# EAGLE design usb1wire (EAGLE 6.2)
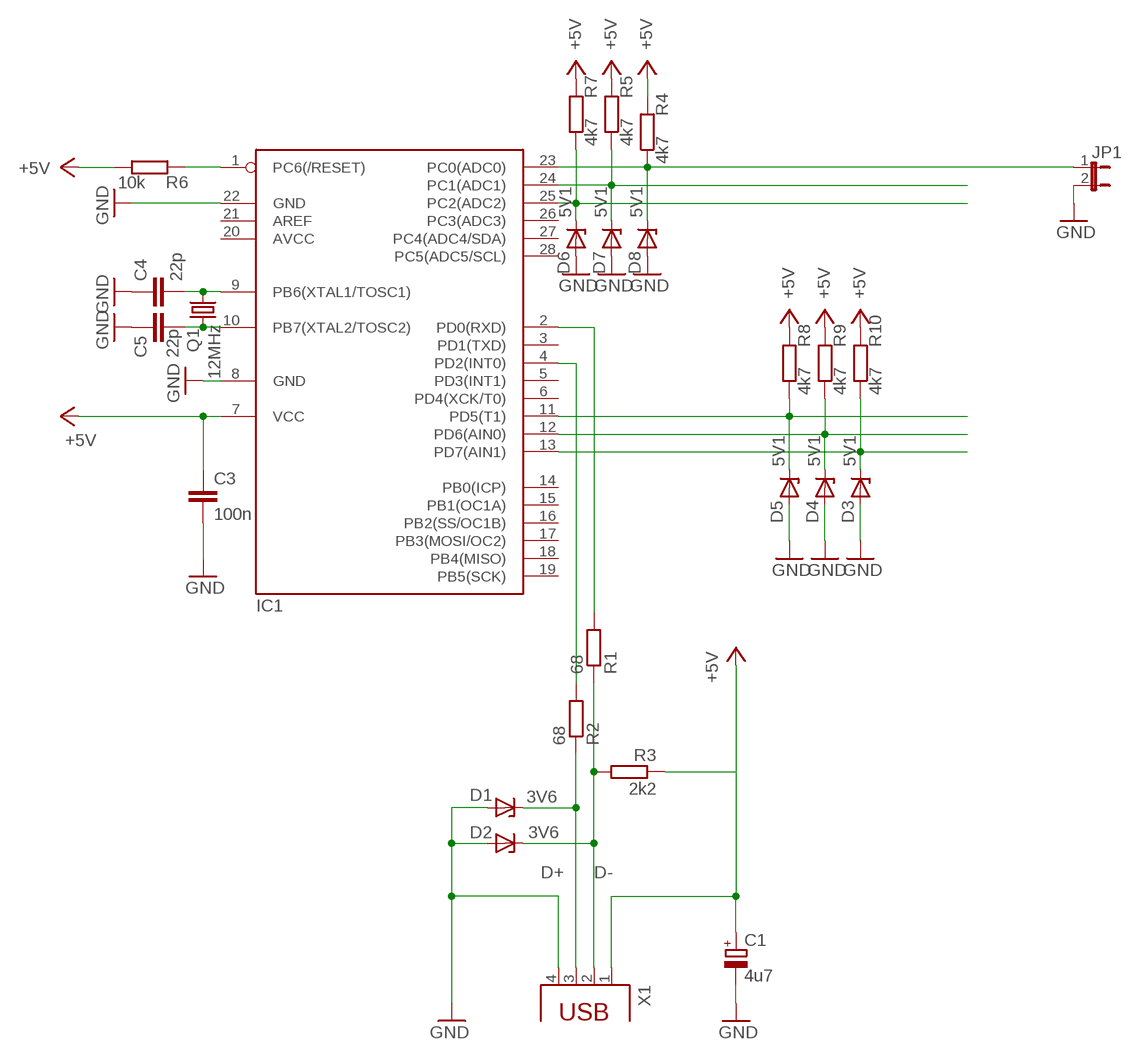
[diagram p0: schematic, sheet 1]

## Parts
C1  4u7  CPOL-EUTT2D4  [TT2D4]
C3  100n  C-EU025-024X044  [C025-024X044]
C4  22p  C-EU025-024X044  [C025-024X044]
C5  22p  C-EU050-025X075  [C050-025X075]
D1  3V6  ZENER-DIODEDO34-7  [DO34Z7]
D2  3V6  ZENER-DIODEZD-5  [ZDIO-5]
D3  5V1  ZENER-DIODEZD-5  [ZDIO-5]
D4  5V1  ZENER-DIODEDO34-7  [DO34Z7]
D5  5V1  ZENER-DIODEDO41Z10  [DO41Z10]
D6  5V1  ZENER-DIODESOD80C  [SOD80C]
D7  5V1  ZENER-DIODESOD80C  [SOD80C]
D8  5V1  ZENER-DIODESOD80C  [SOD80C]
IC1  MEGA8-P  [DIL28-3]
JP1  JP1E  [JP1]
Q1  12MHz  CRYSTALTC26V  [TC26V]
R1  68  R-EU_0207/10  [0207/10]
R2  68  R-EU_0204/2V  [0204V]
R3  2k2  R-EU_0207/2V  [0207/2V]
R4  4k7  R-EU_0207/15  [0207/15]
R5  4k7  R-EU_0207/12  [0207/12]
R6  10k  R-EU_0207/15  [0207/15]
R7  4k7  R-EU_0207/10  [0207/10]
R8  4k7  R-EU_0207/12  [0207/12]
R9  4k7  R-EU_0207/10  [0207/10]
R10  4k7  R-EU_0204/7  [0204/7]
X1  PN61729  [PN61729]

## Nets
+5V: C1.+ C3.1 IC1.7(VCC) R3.1 R4.2 R5.2 R6.1 R7.2 R8.2 R9.2 R10.2 X1.1
D+: D1.C R2.1 X1.3
D-: D2.C R1.1 R3.2 X1.2
GND: C1.- C3.2 C4.1 C5.1 D1.A D2.A D3.A D4.A D5.A D6.A D7.A D8.A IC1.8(GND) IC1.22(GND) JP1.2 X1.4
N$1: IC1.1(PC6(/RESET)) R6.2
N$2: IC1.2(PD0(RXD)) R1.2
N$3: IC1.4(PD2(INT0)) R2.2
N$4: D8.C IC1.23(PC0(ADC0)) JP1.1 R4.1
N$5: D3.C IC1.13(PD7(AIN1)) R10.1
N$6: D7.C IC1.24(PC1(ADC1)) R5.1
N$7: D6.C IC1.25(PC2(ADC2)) R7.1
N$8: D4.C IC1.12(PD6(AIN0)) R9.1
N$9: D5.C IC1.11(PD5(T1)) R8.1
N$22: C4.2 IC1.9(PB6(XTAL1/TOSC1)) Q1.2
N$23: C5.2 IC1.10(PB7(XTAL2/TOSC2)) Q1.1
Unconnected: IC1.3(PD1(TXD)) IC1.5(PD3(INT1)) IC1.6(PD4(XCK/T0)) IC1.14(PB0(ICP)) IC1.15(PB1(OC1A)) IC1.16(PB2(SS/OC1B)) IC1.17(PB3(MOSI/OC2)) IC1.18(PB4(MISO)) IC1.19(PB5(SCK)) IC1.21(AREF) IC1.26(PC3(ADC3)) IC1.27(PC4(ADC4/SDA)) IC1.28(PC5(ADC5/SCL))

## Power pins joined to a net without a drawn wire
AVCC: IC1.20(AVCC)

## Library data of the parts
C1 = rcl:CPOL-EU: POLARIZED CAPACITOR, European symbol
C3-C5 = rcl:C-EU: CAPACITOR, European symbol
D1-D8 = diode:ZENER-DIODE: Z-Diode
IC1 = atmel:MEGA8-P: MICROCONTROLLER 8 Kbytes FLASH, 1 kbytes SRAM, 512 bytes EEPROM, USART, 4-channel 10 bit ADC, 2-channel 8 bit ADC Pin compatible with Atmega48, ATMega88, ATMega168 Source: avr.lbr
JP1 = jumper:JP1E: JUMPER
Q1 = crystal:CRYSTAL: CRYSTAL
R1-R10 = rcl:R-EU_: RESISTOR, European symbol
X1 = con-berg:PN61729: BERG USB connector

## Board
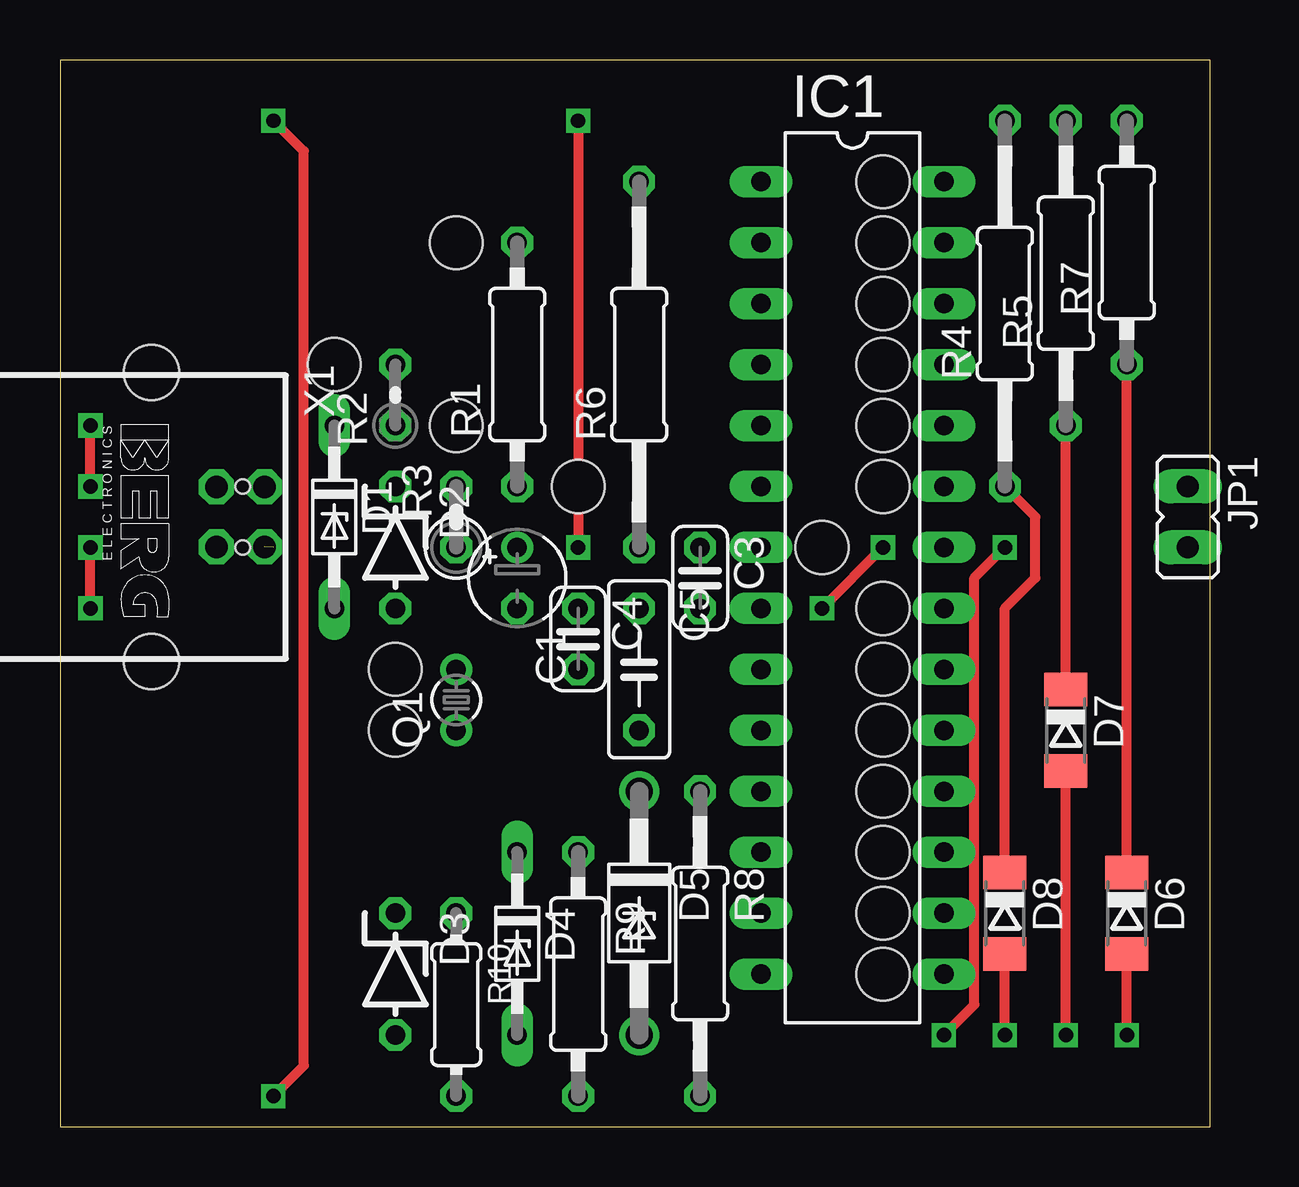
[diagram p1: board, top side]
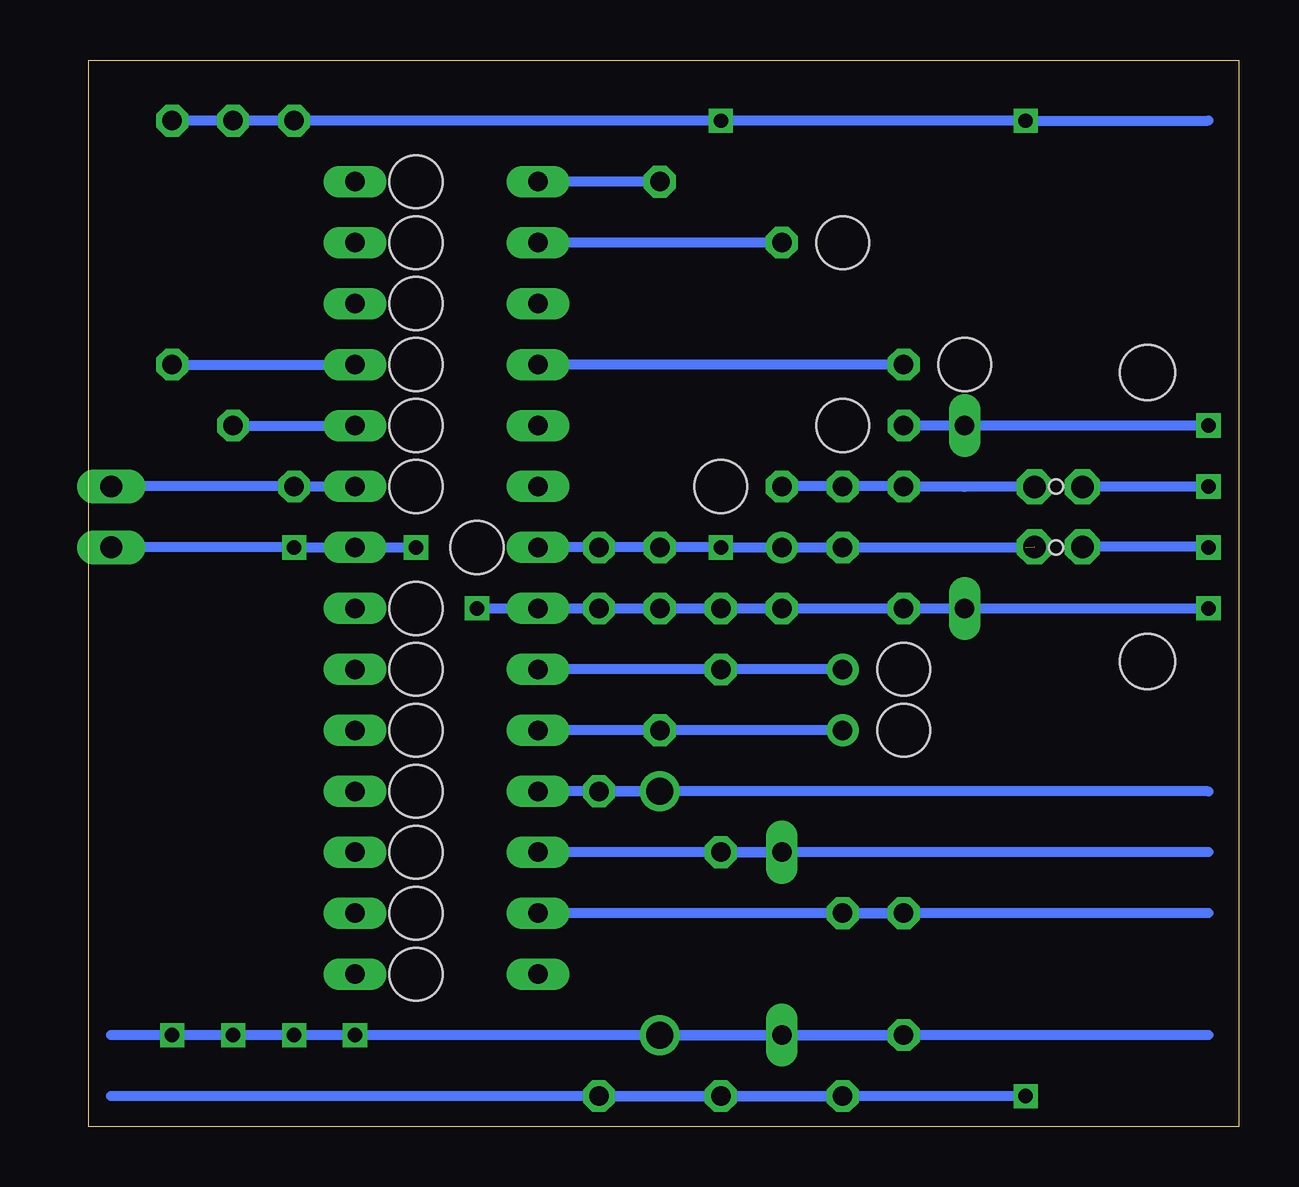
[diagram p2: board, bottom side, seen from below]

Size 47.93 x 44.44 mm. Coordinates in mm from the lower left corner, seen from the top.
Outline: 0,0 47.93,0 47.93,44.44 0,44.44 0,0
Copper layers (1*16): Top 0.035mm / dielectric 1.5mm / Bottom 0.035mm
Design rules: minimum track width 10mil, minimum drill 24mil, track to track 8mil, track to pad 8mil, pad to pad 8mil, via to via 8mil, smd to smd 8mil, copper to edge 40mil, drill to drill 8mil, minimum pad ring 10mil, minimum via ring 8mil, stop-mask expansion 4mil, vias tented up to drill 0mil, thermal gap 10mil
Holes 2.2 mm at 16.51,29.21 21.59,26.67 34.29,39.37 34.29,36.83 34.29,34.29 34.29,31.75 34.29,29.21 34.29,26.67 31.75,24.13 34.29,21.59 34.29,19.05 34.29,16.51 34.29,13.97 34.29,11.43 34.29,8.89 34.29,6.35 13.97,19.05 13.97,16.51 11.43,31.75 16.51,36.83
Holes 0.6 mm at 7.62,24.13 7.62,26.67

### Footprints (pad centres in the part's own frame; a part is rotated, then mirrored left to right if it is on the bottom)
TT2D4 = drill 0.813: + -1.27,0 | drill 0.813 octagon: - 1.27,0
C025-024X044 = drill 0.813 octagon: 1 -1.27,0; 2 1.27,0
C050-025X075 = drill 0.813 octagon: 1 -2.54,0; 2 2.54,0
DO34Z7 = drill 0.813 long: A 3.81,0; C -3.81,0
ZDIO-5 = drill 0.813 octagon: A 2.54,0; C -2.54,0
DO41Z10 = drill 1.118: A 5.08,0; C -5.08,0
SOD80C = smd 1.4 x 1.8: A 1.7,0; C -1.7,0
DIL28-3 = drill 0.813 long: 1 -16.51,-3.81; 2 -13.97,-3.81; 3 -11.43,-3.81; 4 -8.89,-3.81; 5 -6.35,-3.81; 6 -3.81,-3.81; 7 -1.27,-3.81; 8 1.27,-3.81; 9 3.81,-3.81; 10 6.35,-3.81; 11 8.89,-3.81; 12 11.43,-3.81; 13 13.97,-3.81; 14 16.51,-3.81; 15 16.51,3.81; 16 13.97,3.81; 17 11.43,3.81; 18 8.89,3.81; 19 6.35,3.81; 20 3.81,3.81; 21 1.27,3.81; 22 -1.27,3.81; 23 -3.81,3.81; 24 -6.35,3.81; 25 -8.89,3.81; 26 -11.43,3.81; 27 -13.97,3.81; 28 -16.51,3.81
JP1 = drill 0.914 long: 1 0,-1.27; 2 0,1.27
TC26V = drill 0.813: 1 -1.27,0; 2 1.27,0
0207/10 = drill 0.813 octagon: 1 -5.08,0; 2 5.08,0
0204V = drill 0.813 octagon: 1 -1.27,0; 2 1.27,0
0207/2V = drill 0.813 octagon: 1 -1.27,0; 2 1.27,0
0207/15 = drill 0.813 octagon: 1 -7.62,0; 2 7.62,0
0207/12 = drill 0.813 octagon: 1 -6.35,0; 2 6.35,0
0204/7 = drill 0.813 octagon: 1 -3.81,0; 2 3.81,0
PN61729 = drill 0.95 octagon: 1 1.25,4.71; 2 -1.25,4.71; 3 -1.25,2.71; 4 1.25,2.71 | hole 2.3: -6.02,0; 6.02,0

### Placement (x,y rotation side)
C1  19.05,22.86 270 top
C3  26.67,22.86 270 top
C4  21.59,20.32 270 top
C5  24.13,19.05 270 top
D1  11.43,25.4 270 top
D2  13.97,24.13 270 top
D3  13.97,6.35 270 top
D4  19.05,7.62 270 top
D5  24.13,8.89 270 top
D6  44.45,8.89 270 top
D7  41.91,16.51 270 top
D8  39.37,8.89 270 top
IC1  33.02,22.86 270 top
JP1  46.99,25.4 180 top
Q1  16.51,17.78 90 top
R1  19.05,31.75 90 top
R2  13.97,30.48 90 top
R3  16.51,25.4 90 top
R4  39.37,34.29 90 top
R5  41.91,35.56 90 top
R6  24.13,31.75 90 top
R7  44.45,36.83 90 top
R8  26.67,7.62 270 top
R9  21.59,6.35 270 top
R10  16.51,5.08 270 top
X1  3.81,25.4 270 top

### Tracks (layer width: path | path; a pad name or v marks a point on that pad's centre or on a via)
+5V  (via drill 0.6)  (1 unrouted)
  Top 0.406: v21.59,41.91 v21.59,24.13 | v8.89,41.91 10.16,40.64 10.16,2.54 v8.89,1.27
  Bottom 0.406: 8.89,24.13 R3.1 C1.+ v21.59,24.13 R6.1 C3.1 IC1.7 | R7.2 R5.2 R4.2 v21.59,41.91 v8.89,41.91 1.27,41.91 | v8.89,1.27 R8.2 | R8.2 R9.2 R10.2 R8.2 | R8.2 46.99,1.27
D+  (via drill 0.6)
  Top 0.406: v1.27,26.67 v1.27,29.21
  Bottom 0.406: R2.1 D1.C v1.27,29.21 | X1.3 1.27,26.65 v1.27,26.67
D-
  Bottom 0.406: D2.C R3.2 R1.1 | D2.C 11.43,26.65 X1.2 | D2.C 11.43,26.67
GND  (via drill 0.6)
  Top 0.406: v1.27,21.59 v1.27,24.13 | v34.29,24.13 v31.75,21.59 | v44.45,3.81 D6.A | v41.91,3.81 D7.A | v39.37,3.81 D8.A | v39.37,24.13 38.1,22.86 38.1,5.08 v36.83,3.81
  Bottom 0.406: 1.27,24.15 1.27,24.16 | IC1.8 C5.1 C4.1 C1.- D2.A D1.A v1.27,21.59 | IC1.8 C3.2 | 1.27,24.15 X1.4 | v1.27,24.13 1.27,24.15 | v34.29,24.13 IC1.22 v39.37,24.13 JP1.2 | v31.75,21.59 IC1.8 | 46.99,3.81 v44.45,3.81 v41.91,3.81 v39.37,3.81 v36.83,3.81 D3.A D4.A D5.A 1.27,3.81
N$1
  Bottom 0.406: R6.2 IC1.1
N$2
  Bottom 0.406: R1.2 IC1.2
N$3
  Bottom 0.406: R2.2 IC1.4
N$4
  Top 0.406: D8.C 39.37,21.59 40.64,22.86 40.64,25.4 R4.1
  Bottom 0.406: JP1.1 R4.1 IC1.23
N$5
  Bottom 0.406: IC1.13 D3.C R10.1 1.27,8.89
N$6
  Top 0.406: D7.C R5.1
  Bottom 0.406: R5.1 IC1.24
N$7
  Top 0.406: D6.C R7.1
  Bottom 0.406: R7.1 IC1.25
N$8
  Bottom 0.406: IC1.12 D4.C R9.1 1.27,11.43
N$9
  Bottom 0.406: IC1.11 D5.C R8.1 1.27,13.97
N$22
  Bottom 0.406: Q1.2 C4.2 IC1.9
N$23
  Bottom 0.406: IC1.10 C5.2 Q1.1